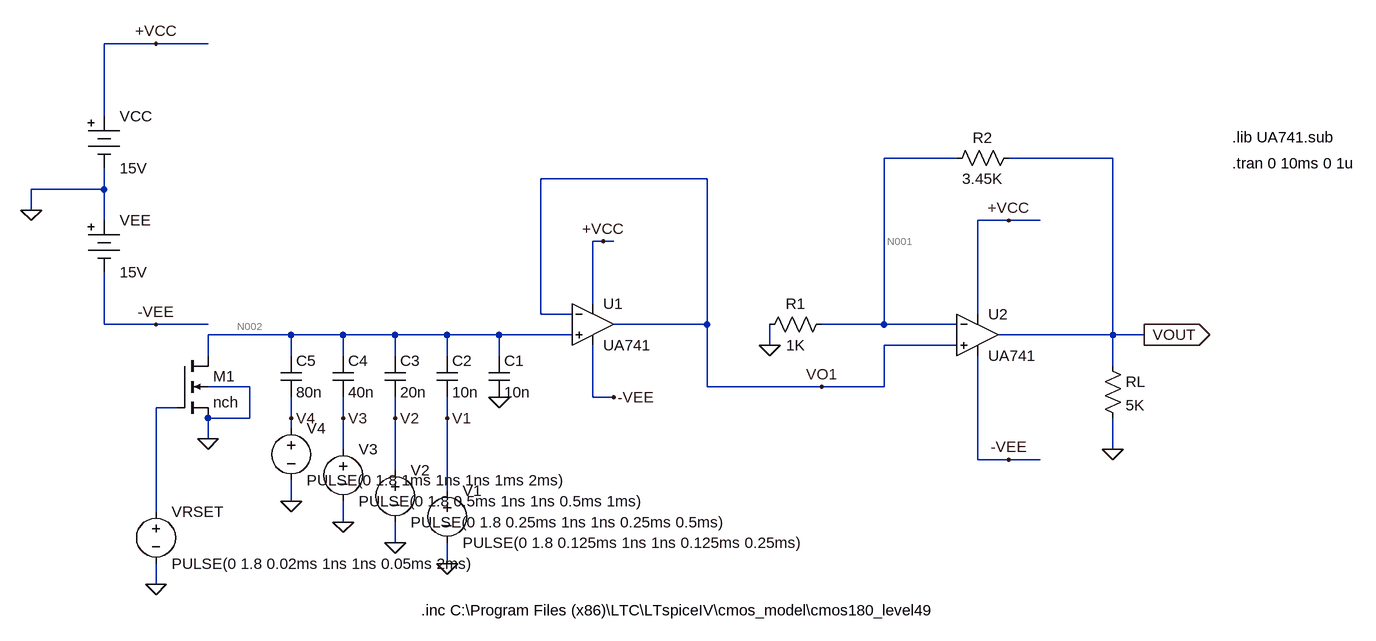
[diagram p0: schematic lab3.asc]
lab3.asc, the LTspice schematic file:
Version 4
SHEET 1 1628 724
WIRE -272 -240 -352 -240
WIRE -192 -240 -272 -240
WIRE -352 -128 -352 -240
WIRE 960 -64 848 -64
WIRE 1200 -64 1040 -64
WIRE 576 -32 320 -32
WIRE -352 -16 -352 -48
WIRE -352 -16 -464 -16
WIRE -464 16 -464 -16
WIRE -352 32 -352 -16
WIRE 1040 32 992 32
WIRE 1088 32 1040 32
WIRE 416 64 400 64
WIRE 432 64 416 64
WIRE 400 160 400 64
WIRE 320 176 320 -32
WIRE 368 176 320 176
WIRE 992 176 992 32
WIRE -352 192 -352 112
WIRE -272 192 -352 192
WIRE -192 192 -272 192
WIRE 576 192 576 -32
WIRE 576 192 432 192
WIRE 848 192 848 -64
WIRE 848 192 752 192
WIRE 960 192 848 192
WIRE -64 208 -192 208
WIRE 16 208 -64 208
WIRE 96 208 16 208
WIRE 176 208 96 208
WIRE 256 208 176 208
WIRE 368 208 256 208
WIRE 1200 208 1200 -64
WIRE 1200 208 1024 208
WIRE 1248 208 1200 208
WIRE 672 224 672 192
WIRE 960 224 848 224
WIRE -192 240 -192 208
WIRE -64 240 -64 208
WIRE 16 240 16 208
WIRE 96 240 96 208
WIRE 176 240 176 208
WIRE 256 240 256 208
WIRE 1200 256 1200 208
WIRE -128 288 -192 288
WIRE 576 288 576 192
WIRE 752 288 576 288
WIRE 848 288 848 224
WIRE 848 288 752 288
WIRE 400 304 400 224
WIRE 432 304 400 304
WIRE -240 320 -272 320
WIRE -128 336 -128 288
WIRE -128 336 -192 336
WIRE -64 336 -64 304
WIRE 16 336 16 304
WIRE 96 336 96 304
WIRE 176 336 176 304
WIRE -64 352 -64 336
WIRE -192 368 -192 336
WIRE 16 384 16 336
WIRE 1200 384 1200 336
WIRE 992 400 992 240
WIRE 1040 400 992 400
WIRE 1088 400 1040 400
WIRE 96 416 96 336
WIRE 176 448 176 336
WIRE -64 464 -64 432
WIRE -272 480 -272 320
WIRE 16 496 16 464
WIRE 96 528 96 496
WIRE 176 560 176 528
WIRE -272 592 -272 560
FLAG 1248 208 VOUT
IOPIN 1248 208 Out
FLAG -464 16 0
FLAG -272 -240 +VCC
FLAG 1040 32 +VCC
FLAG -272 192 -VEE
FLAG 1040 400 -VEE
FLAG 1200 384 0
FLAG 416 64 +VCC
FLAG 432 304 -VEE
FLAG 672 224 0
FLAG 256 304 0
FLAG -64 464 0
FLAG 16 496 0
FLAG 96 528 0
FLAG 176 560 0
FLAG -192 368 0
FLAG -272 592 0
FLAG -64 336 V4
FLAG 16 336 V3
FLAG 96 336 V2
FLAG 176 336 V1
FLAG 752 288 VO1
SYMBOL Opamps\\opamp2 992 144 R0
SYMATTR InstName U2
SYMATTR Value UA741
SYMBOL res 1184 240 R0
SYMATTR InstName RL
SYMATTR Value 5K
SYMBOL Misc\\battery -352 -144 R0
SYMATTR InstName VCC
SYMATTR Value 15V
SYMBOL Misc\\battery -352 16 R0
SYMATTR InstName VEE
SYMATTR Value 15V
SYMBOL res 768 176 R90
WINDOW 0 0 56 VBottom 2
WINDOW 3 32 56 VTop 2
SYMATTR InstName R1
SYMATTR Value 1K
SYMBOL res 1056 -80 R90
WINDOW 0 0 56 VBottom 2
WINDOW 3 32 56 VTop 2
SYMATTR InstName R2
SYMATTR Value 3.45K
SYMBOL Opamps\\opamp2 400 128 R0
SYMATTR InstName U1
SYMATTR Value UA741
SYMBOL cap 240 240 R0
SYMATTR InstName C1
SYMATTR Value 10n
SYMBOL cap 160 240 R0
SYMATTR InstName C2
SYMATTR Value 10n
SYMBOL cap 80 240 R0
SYMATTR InstName C3
SYMATTR Value 20n
SYMBOL cap 0 240 R0
SYMATTR InstName C4
SYMATTR Value 40n
SYMBOL voltage 176 432 R0
WINDOW 123 0 0 Left 2
WINDOW 39 0 0 Left 2
SYMATTR InstName V1
SYMATTR Value PULSE(0 1.8 0.125ms 1ns 1ns 0.125ms 0.25ms)
SYMBOL voltage 96 400 R0
WINDOW 123 0 0 Left 2
WINDOW 39 0 0 Left 2
SYMATTR InstName V2
SYMATTR Value PULSE(0 1.8 0.25ms 1ns 1ns 0.25ms 0.5ms)
SYMBOL voltage 16 368 R0
WINDOW 123 0 0 Left 2
WINDOW 39 0 0 Left 2
SYMATTR InstName V3
SYMATTR Value PULSE(0 1.8 0.5ms 1ns 1ns 0.5ms 1ms)
SYMBOL voltage -64 336 R0
WINDOW 123 0 0 Left 2
WINDOW 39 0 0 Left 2
SYMATTR InstName V4
SYMATTR Value PULSE(0 1.8 1ms 1ns 1ns 1ms 2ms)
SYMBOL cap -80 240 R0
SYMATTR InstName C5
SYMATTR Value 80n
SYMBOL nmos4 -240 240 R0
SYMATTR InstName M1
SYMATTR Value nch
SYMATTR Value2 l=0.18u w=50u
SYMBOL voltage -272 464 R0
WINDOW 123 0 0 Left 2
WINDOW 39 0 0 Left 2
SYMATTR InstName VRSET
SYMATTR Value PULSE(0 1.8 0.02ms 1ns 1ns 0.05ms 2ms)
TEXT 1384 -96 Left 2 !.lib UA741.sub
TEXT 1384 -56 Left 2 !.tran 0 10ms 0 1u
TEXT 136 632 Left 2 !.inc C:\\Program Files (x86)\\LTC\\LTspiceIV\\cmos_model\\cmos180_level49

The netlist it stands for:
* lab3.asc
XU2 VO1 N001 +VCC -VEE VOUT UA741  ; pins In+ In- V+ V- OUT
RL VOUT 0 5K
VCC +VCC 0 15V
VEE 0 -VEE 15V
R1 N001 0 1K
R2 VOUT N001 3.45K
XU1 N002 VO1 +VCC -VEE VO1 UA741  ; pins In+ In- V+ V- OUT
C1 N002 0 10n
C2 N002 V1 10n
C3 N002 V2 20n
C4 N002 V3 40n
V1 V1 0 PULSE(0 1.8 0.125ms 1ns 1ns 0.125ms 0.25ms)
V2 V2 0 PULSE(0 1.8 0.25ms 1ns 1ns 0.25ms 0.5ms)
V3 V3 0 PULSE(0 1.8 0.5ms 1ns 1ns 0.5ms 1ms)
V4 V4 0 PULSE(0 1.8 1ms 1ns 1ns 1ms 2ms)
C5 N002 V4 80n
M1 N002 N003 0 0 nch l=0.18u w=50u
VRSET N003 0 PULSE(0 1.8 0.02ms 1ns 1ns 0.05ms 2ms)
.model NMOS NMOS
.model PMOS PMOS
.lib standard.mos
.lib UA741.sub
.tran 0 10ms 0 1u
.inc C:\Program Files (x86)\LTC\LTspiceIV\cmos_model\cmos180_level49
.backanno
.end

* Results of the author's LTspice run, read from the files saved beside the schematic
* Operating Point, zero values left out:
*   V(vout) = -806.1 mV
*   V(-vee) = -15 V
*   V(+vcc) = 15 V
*   V(n001) = -181.2 mV
*   V(vo1) = -181.2 mV
*   V(n002) = -181.2 mV
*   Id(M1) = -79.66 nA
*   Ib(M1) = 11.22 pA
*   Is(M1) = 79.65 nA
*   I(R2) = -181.1 µA
*   I(R1) = -181.2 µA
*   I(Rl) = -161.2 µA
*   I(Vee) = -3.333 mA
*   I(Vcc) = -3.333 mA
*   Ix(u2:1) = 79.66 nA
*   Ix(u2:2) = 79.69 nA
*   Ix(u2:3) = 1.667 mA
*   Ix(u2:4) = -1.667 mA
*   Ix(u2:5) = 342.3 µA
*   Ix(u1:1) = 79.66 nA
*   Ix(u1:2) = 79.69 nA
*   Ix(u1:3) = 1.667 mA
*   Ix(u1:4) = -1.667 mA
*   Ix(u1:5) = -159.3 nA
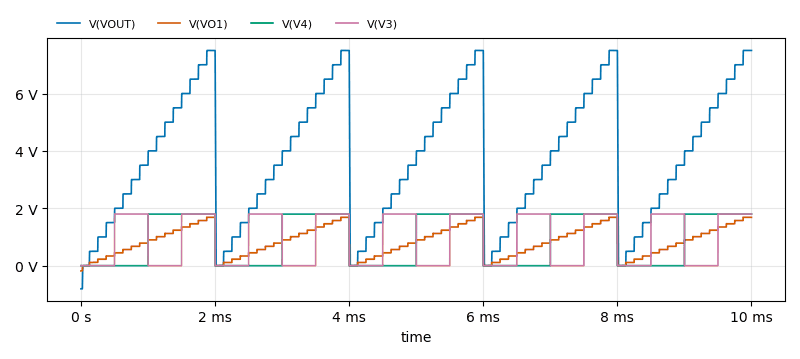
[diagram p1: Transient Analysis of lab3.asc, plotted from the saved traces]
* Transient Analysis, 1 run:
*   V(VOUT): min -806.1 mV, max 7.508 V, average 3.77 V, rms 4.416 V, last 7.505 V
*   V(VO1): min -181.2 mV, max 1.691 V, average 843.8 mV, rms 990.4 mV, last 1.686 V
*   V(V4): min 0 V, max 1.8 V, average 900 mV, rms 1.273 V, last 1.8 V
*   V(V3): min 0 V, max 1.8 V, average 900 mV, rms 1.273 V, last 1.8 V